# Altium schematic sheet OZ440-SE100-CAR003_sheet12.SchDoc
size A3
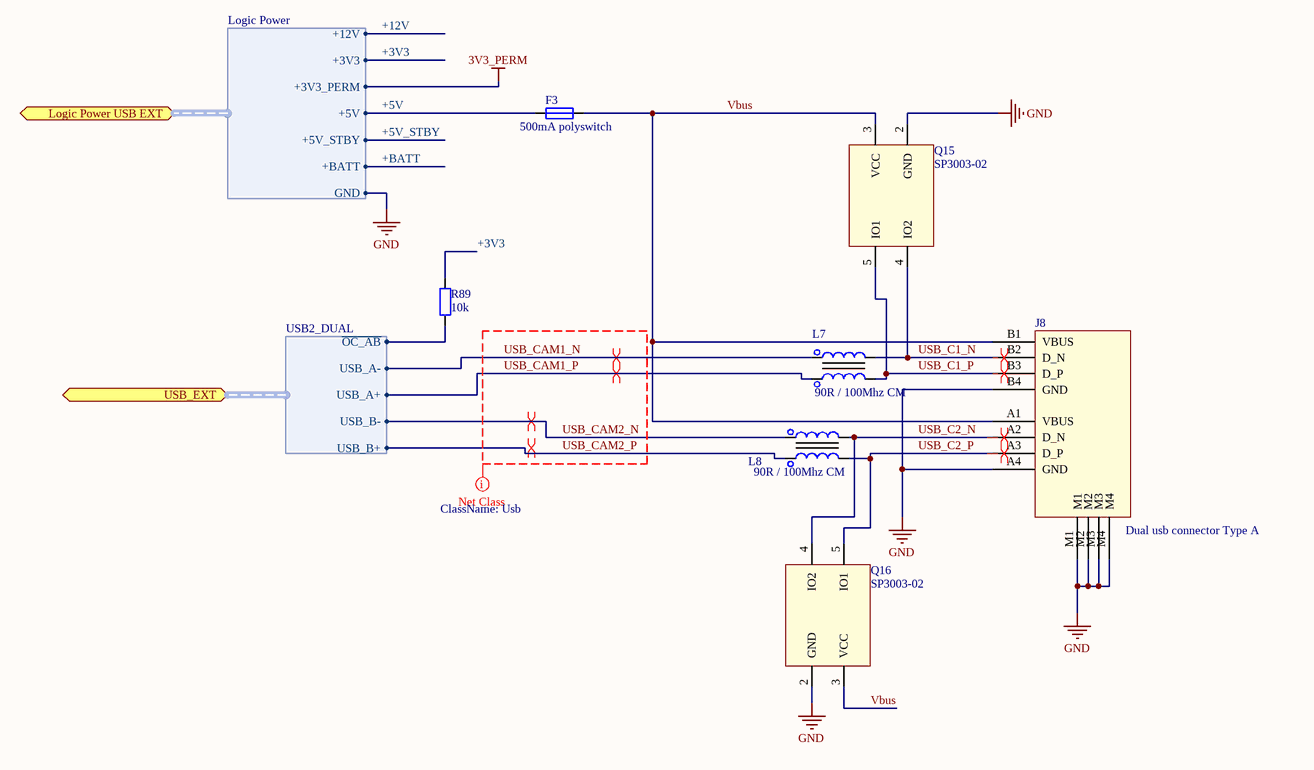
[diagram p0: OZ440-SE100-CAR003_sheet12.SchDoc]

## Parts
F3  Displayed reference: 500mA polyswitch  [R0805-STD]  (hidden comment: FUSE-SMD)
J8  Displayed reference: Dual usb connector Type A  [CONN-STD-USB_A]  (hidden comment: CONN-STD_USB_A_DUAL)
L7  Displayed reference: 90R / 100Mhz CM  [L-SPE-0805_MC_EXC34]  (hidden comment: IND-MC-SMD)
L8  Displayed reference: 90R / 100Mhz CM  [L-SPE-0805_MC_EXC34]  (hidden comment: IND-MC-SMD)
Q15  Displayed reference: SP3003-02  [SC70-SPE-SP3003]  (hidden comment: SP03003_02-SC70)
Q16  Displayed reference: SP3003-02  [SC70-SPE-SP3003]  (hidden comment: SP03003_02-SC70)
R89  Displayed reference: 10k  [R0805-STD]  (hidden comment: RES-SMD)

## Ports
Logic Power USB EXT (harness Logic Power), USB_EXT (harness USB2_DUAL)

## Harnesses
USB2_DUAL: ~{OC_AB}, USB_A-, USB_A+, USB_B-, USB_B+
Logic Power: +12V, +3V3, +3V3_PERM, +5V, +5V_STBY, +BATT, GND

## Nets
3V3_PERM: port Logic Power USB EXT.+3V3_PERM
GND: J8.A4(GND) J8.B4(GND) J8.M1 J8.M2 J8.M3 J8.M4 Q15.2(GND) Q16.2(GND) ; port Logic Power USB EXT.GND
+3V3: R89.2 ; port Logic Power USB EXT.+3V3
+5V: F3.1 ; port Logic Power USB EXT.+5V
+5V_STBY: port Logic Power USB EXT.+5V_STBY
+12V: port Logic Power USB EXT.+12V
+BATT: port Logic Power USB EXT.+BATT
USB_C1_N: J8.B2(D_N) L7.2 Q15.4(IO2)
USB_C1_P: J8.B3(D_P) L7.3 Q15.5(IO1)
USB_C2_N: J8.A2(D_N) L8.2 Q16.4(IO2)
USB_C2_P: J8.A3(D_P) L8.3 Q16.5(IO1)
USB_CAM1_N: L7.1 ; port USB_EXT.USB_A-
USB_CAM1_P: L7.4 ; port USB_EXT.USB_A+
USB_CAM2_N: L8.1 ; port USB_EXT.USB_B-
USB_CAM2_P: L8.4 ; port USB_EXT.USB_B+
Vbus: F3.2 J8.A1(VBUS) J8.B1(VBUS) Q15.3(VCC) Q16.3(VCC)
NetR89_1: R89.1 ; port USB_EXT.~{OC_AB}

## Layout directives
differential pair: USB_C1_N, USB_C1_P, USB_C2_N, USB_C2_P, USB_CAM1_N, USB_CAM1_P, USB_CAM2_N, USB_CAM2_P
net class Usb: USB_CAM1_N, USB_CAM1_P, USB_CAM2_N, USB_CAM2_P

## Notes on the sheet
- Titre document:
- NAIO TECHNOLOGIES
- 3 Av didier Daurat
- 31400 TOULOUSE
- Auteur:
- Numéro document:
- Verificateur:
- Format:
- A3
- Date:
- Revision:
- Page:
- /

## Library data of the parts
F3 = MF-PSMF050X-2: 0805 500mA resettable fuse; Manufacturer: BOURNS; Validated: False; Reference: MF-PSMF050X-2; Max Current: 500mA; Pin Count: 2; helpURL: http://www.farnell.com/datasheets/1442129.pdf; Supplier 1: Farnell; Supplier Part Number 1: 1294876; Supplier 2: Mouser; Supplier Part Number 2: 652-MF-PSMF050X-2
J8 = 72309-8044BLF: Dual USB Type A connector; Manufacturer: FCI; Validated: False; Reference: 72309-8044BLF; Footprint description: Dual USB type A; Pin Count: 8; Rev: AJ; helpURL: http://portal.fciconnect.com/Comergent//fci/drawing/72309.pdf; Supplier 1: Mouser; Supplier Part Number 1: 649-72309-8044BLF; Supplier 2: Farnell; Supplier Part Number 2: 1835462
L7 L8 = EXC34CE900: USB common mode inductor; Manufacturer: PANASONIC; Max Current: 0.25A; Validated: False; Reference: EXC34CE900; Footprint description: SMD 4 pin; Pin Count: 4; Rev: 11/2012; helpURL: http://www.farnell.com/datasheets/1790924.pdf; Supplier 1: Farnell; Supplier Part Number 1: 1893883; Supplier 2: Mouser; Supplier Part Number 2: 667-EXC-34CE900U
Q15 Q16 = SP3003-02JTG: Low capacitance ESD TVS; Manufacturer: LITTLEFUSE; Max Voltage: 8V; Reference: SP3003-02JTG; component type: DIODE; Footprint description: SC70; Pin Count: 5; Rev: 20/08/13; helpURL: http://www.littelfuse.com/~/media/electronics/datasheets/tvs_diode_arrays/littelfuse_tvs_diode_array_sp3003_datasheet.pdf.pdf; Supplier 1: Farnell; Supplier Part Number 1: 2369568; Supplier 2: Mouser; Supplier Part Number 2: 576-SP3003-02JTG
R89 = CRCW080510K0FKxx: 10k Ohm 0805 SMD resistor; Manufacturer: Vishay; Value: 10 000; Tolerance: 1 %; Rated Power: 0,125 W; Validated: No; Reference: CRCW080510K0FKxx; Footprint description: standard 0805 SMD; Pin Count: 2; helpURL: http://www.vishay.com/docs/20035/dcrcwe3.pdf; Supplier 1: Farnell; Supplier Part Number 1: 1469856; Supplier 2: Mouser; Supplier Part Number 2: 71-CRCW0805-10K-E3